# EAGLE design open-usb-can-rev2 (EAGLE 6.2)
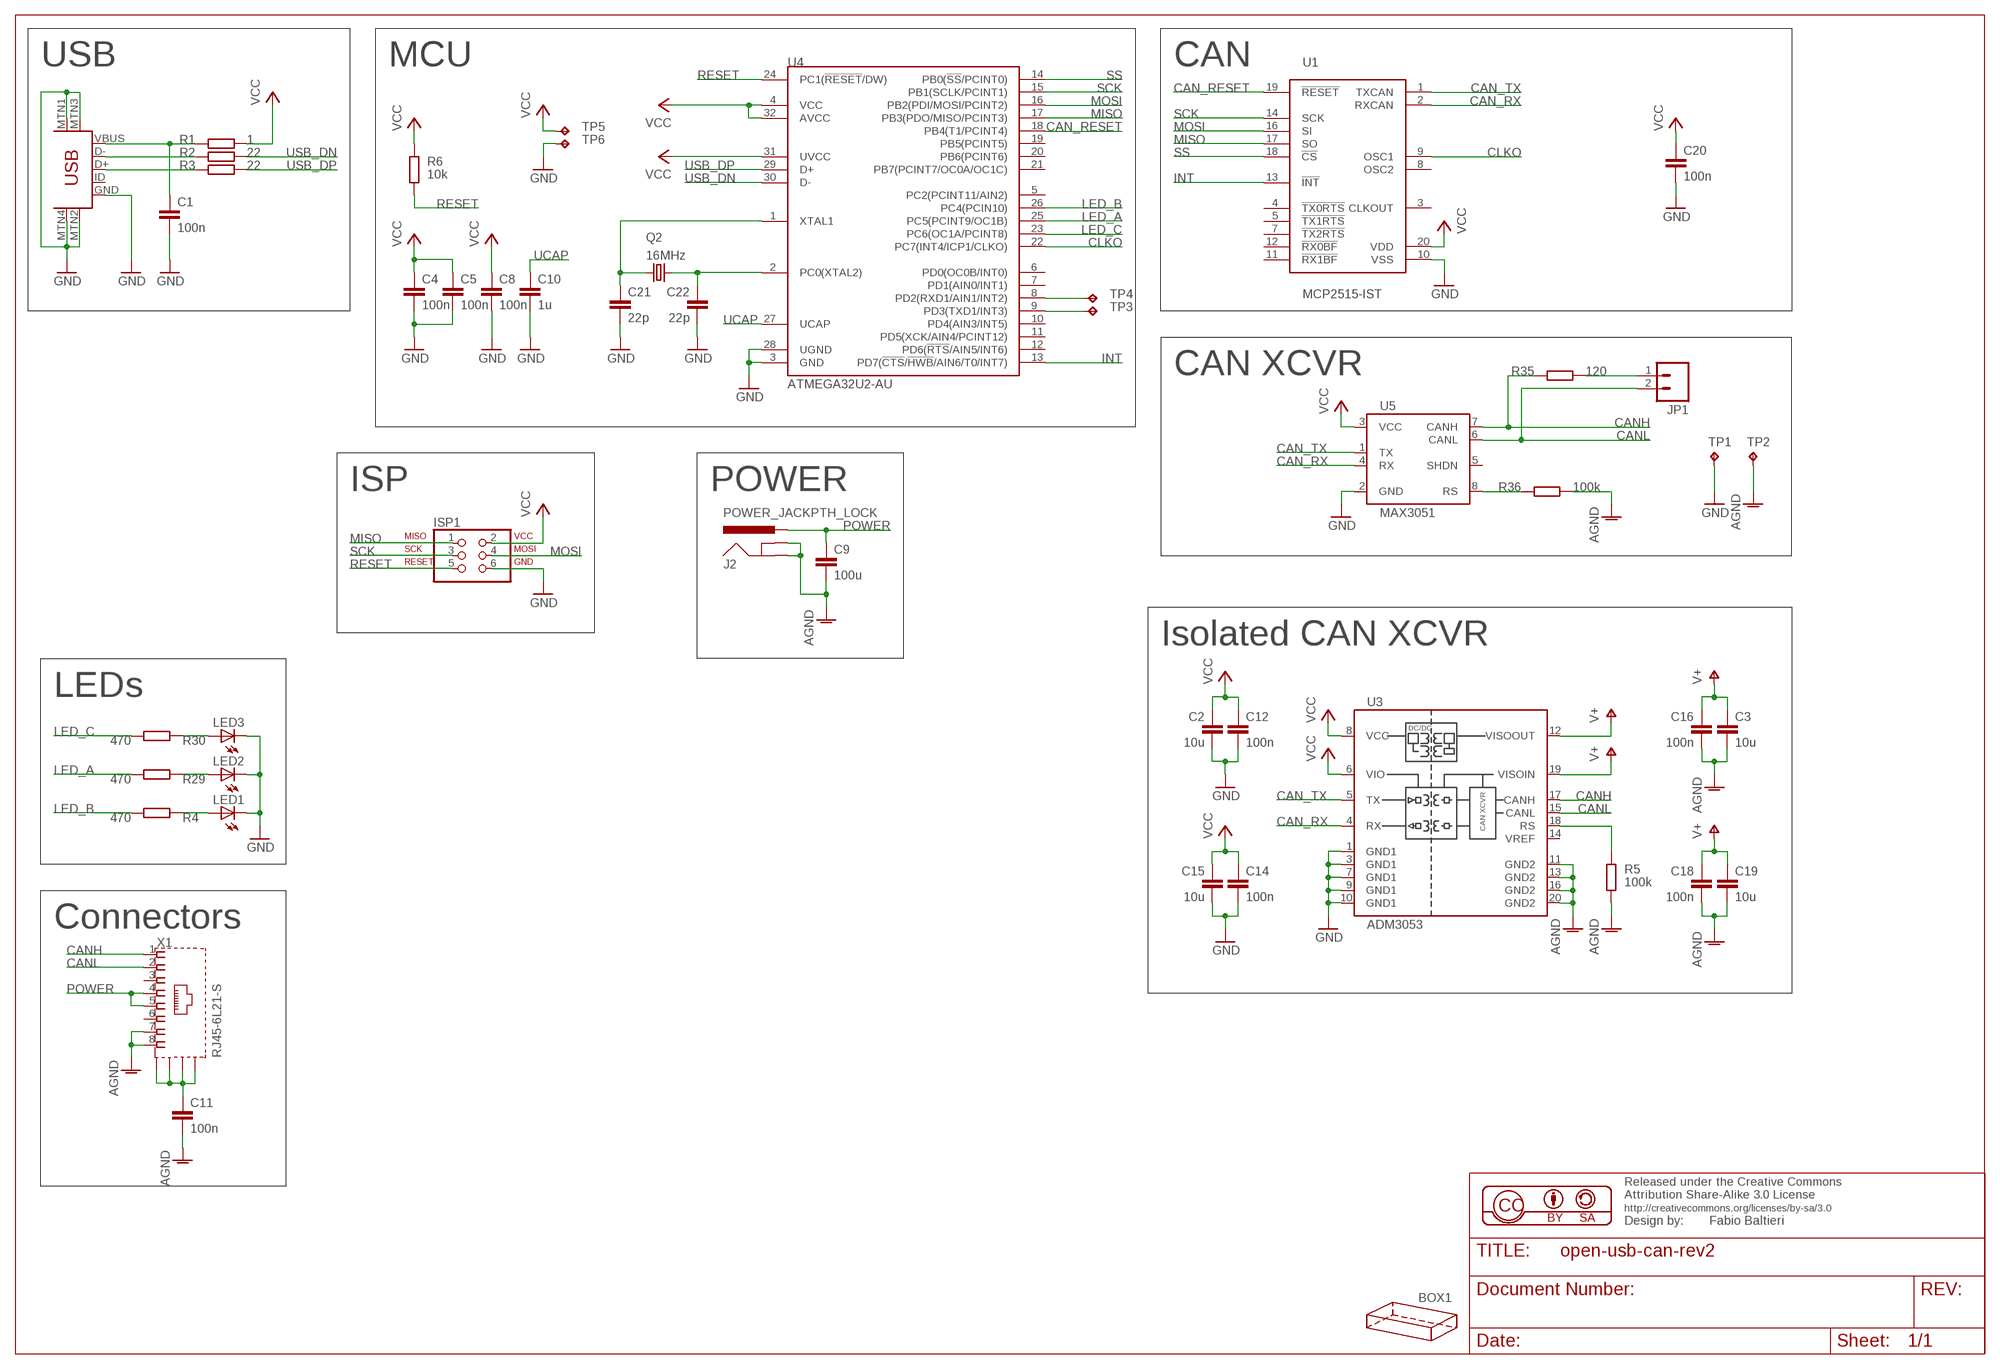
[diagram p0: schematic, sheet 1]

## Parts
BOX1  HAMMOND-BOX-R  [1151R]
C1  100n  C-EUC0805  [C0805]
C2  10u  C-EUC0805  [C0805]
C3  10u  C-EUC0805  [C0805]
C4  100n  C-EUC0805  [C0805]
C5  100n  C-EUC0805  [C0805]
C8  100n  C-EUC0805  [C0805]
C9  100u  C-EUC0805  [C0805]
C10  1u  C-EUC0805  [C0805]
C11  100n  C-EUC0805  [C0805]
C12  100n  C-EUC0805  [C0805]
C14  100n  C-EUC0805  [C0805]
C15  10u  C-EUC0805  [C0805]
C16  100n  C-EUC0805  [C0805]
C18  100n  C-EUC0805  [C0805]
C19  10u  C-EUC0805  [C0805]
C20  100n  C-EUC0805  [C0805]
C21  22p  C-EUC0805  [C0805]
C22  22p  C-EUC0805  [C0805]
ISP1  ISP-AVR910PTH  [2X03]
J2  POWER_JACKPTH_LOCK  [POWER_JACK_PTH_LOCK]
JP1  M02PTH  [1X02]
LED1  LEDCHIPLED_0805  [CHIPLED_0805]
LED2  LEDCHIPLED_0805  [CHIPLED_0805]
LED3  LEDCHIPLED_0805  [CHIPLED_0805]
Q2  16MHz  CRYSTAL5X3  [CRYSTAL-SMD-5X3]
R1  1  R-EU_R0603  [R0603]
R2  22  R-EU_R0603  [R0603]
R3  22  R-EU_R0603  [R0603]
R4  470  R-EU_R0603  [R0603]
R5  100k  R-EU_R0603  [R0603]
R6  10k  R-EU_R0603  [R0603]
R29  470  R-EU_R0603  [R0603]
R30  470  R-EU_R0603  [R0603]
R35  120  R-EU_R0805  [R0805]
R36  100k  R-EU_R0603  [R0603]
TP1  TPTP16SQ  [TP16SQ]
TP2  TPTP16SQ  [TP16SQ]
TP3  TPTP11R  [TP11R]
TP4  TPTP11R  [TP11R]
TP5  TPTP11R  [TP11R]
TP6  TPTP11R  [TP11R]
U1  MCP2515-IST  [TSSOP20]
U3  ADM3053  [SO20W]
U4  ATMEGA32U2-AU  [TQFP32-08]
U5  MAX3051  [SO08]
U$2  USB-MINIB-5PIN  [USB-MINIB]
X1  RJ45-6L21-S  [RJ45-SHIELD1]

## Nets
AGND: C3.2 C9.2 C11.2 C16.2 C18.2 C19.2 J2.GND J2.GNDBREAK R5.2 R36.2 TP2.TP U3.11(GND2) U3.13(GND2) U3.16(GND2) U3.20(GND2) X1.7 X1.8
CAN_RESET: U1.19(!RESET) U4.18(PB4(T1/PCINT4))
CAN_RX: U1.2(RXCAN) U3.4(RX) U5.4(RX)
CAN_TX: U1.1(TXCAN) U3.5(TX) U5.1(TX)
CANH: R35.1 U3.17(CANH) U5.7(CANH) X1.1
CANL: JP1.2 U3.15(CANL) U5.6(CANL) X1.2
CLKO: U1.9(OSC1) U4.22(PC7(INT4/ICP1/CLKO))
GND: C1.2 C2.2 C4.2 C5.2 C8.2 C10.2 C12.2 C14.2 C15.2 C20.2 C21.2 C22.2 ISP1.6 LED1.C LED2.C LED3.C TP1.TP TP6.TP U1.10(VSS) U3.1(GND1) U3.3(GND1) U3.7(GND1) U3.9(GND1) U3.10(GND1) U4.3(GND) U4.28(UGND) U5.2(GND) U$2.GND U$2.MTN1(MTN2) U$2.MTN2(MTN3) U$2.MTN3(MTN1) U$2.MTN4
INT: U1.13(!INT) U4.13(PD7(!CTS!/!HWB!/AIN6/T0/INT7))
LED_A: R29.2 U4.25(PC5(PCINT9/OC1B))
LED_B: R4.2 U4.26(PC4(PCIN10))
LED_C: R30.2 U4.23(PC6(OC1A/PCINT8))
MISO: ISP1.1 U1.17(SO) U4.17(PB3(PDO/MISO/PCINT3))
MOSI: ISP1.4 U1.16(SI) U4.16(PB2(PDI/MOSI/PCINT2))
N$1 [power16]: C1.1 R1.1 U$2.VBUS
N$2: R2.1 U$2.D-
N$3: R3.1 U$2.D+
N$6: C21.1 Q2.1 U4.1(XTAL1)
N$7: C22.1 Q2.3 U4.2(PC0(XTAL2))
N$8: LED1.A R4.1
N$9: C11.1 X1.S1(S) X1.S2(S) X1.S3(S) X1.S4(S)
N$11: R5.1 U3.18(RS)
N$23: LED2.A R29.1
N$24: LED3.A R30.1
N$25: R36.1 U5.8(RS)
N$27: JP1.1 R35.2
POWER: C9.1 J2.PWR X1.4 X1.5
RESET: ISP1.5 R6.2 U4.24(PC1(!RESET!/DW))
RX: TP4.TP U4.8(PD2(RXD1/AIN1/INT2))
SCK: ISP1.3 U1.14(SCK) U4.15(PB1(SCLK/PCINT1))
SS: U1.18(!CS) U4.14(PB0(!SS!/PCINT0))
TX: TP3.TP U4.9(PD3(TXD1/INT3))
UCAP [power12]: C10.1 U4.27(UCAP)
USB_DN: R2.2 U4.30(D-)
USB_DP: R3.2 U4.29(D+)
V+: C3.1 C16.1 C18.1 C19.1 U3.12(VISOOUT) U3.19(VISOIN)
VCC [power16]: C2.1 C4.1 C5.1 C8.1 C12.1 C14.1 C15.1 C20.1 ISP1.2 R1.2 R6.1 TP5.TP U1.20(VDD) U3.6(VIO) U3.8(VCC) U4.4(VCC) U4.31(UVCC) U4.32(AVCC) U5.3(VCC)
Unconnected: U1.3(CLKOUT) U1.4(!TX0RTS) U1.5(!TX1RTS) U1.7(!TX2RTS) U1.8(OSC2) U1.11(!RX1BF) U1.12(!RX0BF) U3.2(NC) U3.14(VREF) U4.5(PC2(PCINT11/AIN2)) U4.6(PD0(OC0B/INT0)) U4.7(PD1(AIN0/INT1)) U4.10(PD4(AIN3/INT5)) U4.11(PD5(XCK/AIN4/PCINT12)) U4.12(PD6(!RTS!/AIN5/INT6)) U4.19(PB5(PCINT5)) U4.20(PB6(PCINT6)) U4.21(PB7(PCINT7/OC0A/OC1C)) U5.5(SHDN) U$2.ID X1.3 X1.6

## Notes on the sheet
- USB | MCU | CAN
- CAN XCVR
- ISP | POWER
- Isolated CAN XCVR
- LEDs
- Connectors

## Library data of the parts
BOX1 = hammond:HAMMOND-BOX: Hammond Project boxes Hammond 1551 Transluscent Blue 50x35x20mm 1551GTBU http://www.hammondmfg.com/pdf/1551G.pdf Hammond 1551 Transluscent Blue 50x50x20mm 1551RTBU http://www.hammondmfg.com/pdf/1551R.pdf Hammond 1551 Transluscent Blue 60x35x20mm 1551HTBU http://www.hammondmfg.com/pdf/1551H.pdf Hammond 1551 Transluscent Blue 80x40x20mm 1551KTBU http://www.hammondmfg.com/pdf/1551K.pdf Hammond 1591 Transluscent Blue 100x51x22m m 1591XXATBU http://www.hammondmfg.com/pdf/1591XXA.pdf
C1-C5 C8-C12 C14-C16 C18-C22 = rcl:C-EU: CAPACITOR, European symbol
ISP1 = balto:ISP-AVR910: PIN HEADER
J2 = sparkfun:POWER_JACK: Power Jack This is the standard 5.5mm barrel jack for power. The PTH is the most common, proven, reliable, footprint. All others are experimental. The Slot footprint only works if the mill layer is transmitted to the PCB fab house so be warned. Spark Fun Electronics SKU : PRT-00119. Mating wall wart : TOL-00298 (and others)
JP1 = SparkFun-Connectors:M02: Header 2 Standard 2-pin 0.1" header. Use with straight break away headers (SKU : PRT-00116), right angle break away headers (PRT-00553), swiss pins (PRT-00743), machine pins (PRT-00117), and female headers (PRT-00115). Molex polarized connector foot print use with SKU : PRT-08233 with associated crimp pins and housings.
LED1-LED3 = led:LED: LED OSRAM: - CHIPLED LG R971, LG N971, LY N971, LG Q971, LY Q971, LO R971, LY R971 LH N974, LH R974 LS Q976, LO Q976, LY Q976 LO Q996 - Hyper CHIPLED LW Q18S LB Q993, LB Q99A, LB R99A - SideLED LS A670, LO A670, LY A670, LG A670, LP A670 LB A673, LV A673, LT A673, LW A673 LH A674 LY A675 LS A676, LA A676, LO A676, LY A676, LW A676 LS A679, LY A679, LG A679 - Hyper Micro SIDELED® LS Y876, LA Y876, LO Y876, LY Y876 LT Y87S - SmartLED LW L88C, LW L88S LB L89C, LB L89S, LG L890 LS L89K, LO L89K, LY L89K LS L896, LA L896, LO L896, LY L896 - TOPLED LS T670, LO T670, LY T670, LG T670, LP T670 LSG T670, LSP T670, LSY T670, LOP T670, LYG T670 LG T671, LOG T671, LSG T671 LB T673, LV T673, LT T673, LW T673 LH T674 LS T676, LA T676, LO T676, LY T676, LB T676, LH T676, LSB T676, LW T676 LB T67C, LV T67C, LT T67C, LS T67K, LO T67K, LY T67K, LW E67C LS E67B, LA E67B, LO E67B, LY E67B, LB E67C, LV E67C, LT E67C LW T67C LS T679, LY T679, LG T679 LS T770, LO T770, LY T770, LG T770, LP T770 LB T773, LV T773, LT T773, LW T773 LH T774 LS E675, LA E675, LY E675, LS T675 LS T776, LA T776, LO T776, LY T776, LB T776 LHGB T686 LT T68C, LB T68C - Hyper Mini TOPLED® LB M676 - Mini TOPLED Santana® LG M470 LS M47K, LO M47K, LY M47K Source: http://www.osram.convergy.de LUXEON: - LUMILED® LXK2-PW12-R00, LXK2-PW12-S00, LXK2-PW14-U00, LXK2-PW14-V00 LXK2-PM12-R00, LXK2-PM12-S00, LXK2-PM14-U00 LXK2-PE12-Q00, LXK2-PE12-R00, LXK2-PE12-S00, LXK2-PE14-T00, LXK2-PE14-U00 LXK2-PB12-K00, LXK2-PB12-L00, LXK2-PB12-M00, LXK2-PB14-N00, LXK2-PB14-P00, LXK2-PB14-Q00 LXK2-PR12-L00, LXK2-PR12-M00, LXK2-PR14-Q00, LXK2-PR14-R00 LXK2-PD12-Q00, LXK2-PD12-R00, LXK2-PD12-S00 LXK2-PH12-R00, LXK2-PH12-S00 LXK2-PL12-P00, LXK2-PL12-Q00, LXK2-PL12-R00 Source: www.luxeon.com KINGBRIGHT: KA-3528ASYC Source: www.kingbright.com
Q2 = sparkfun:CRYSTAL: Crystals Various standard crystals. Proven footprints. Spark Fun Electronics SKU : COM-00534
R1-R6 R29 R30 R35 R36 = rcl:R-EU_: RESISTOR, European symbol
TP1-TP6 = testpad:TP: Test pad
U1 = balto:MCP2515: MCP2515 Stand-Alone CAN Controller With SPI Interface
U3 = balto:ADM3053
U4 = balto:ATMEGA32U2: Atmel 8-bit Microcontroller with 8/16/32K Bystes of ISP Flash and USB Controller. ATmega8U2, ATmega16U2, and ATmega32U2
U5 = balto:MAX3051
U$2 = sparkfun:USB-MINIB: Mini-USB "B" connector with 5th pin broken out. Created new symbol breaking out 5th "ID" pin in mini/micro USB connector spec. See: http://en.wikipedia.org/wiki/Mini_usb#Cables. Uses same footprint as 4-pin symbol. Also added pins to connect to mounting / shield pads if required (probably not generally needed as signals aren't shielded once they leave the connector).
X1 = con-tycoelectronics:RJ45*2: RJ45 Low Profile Shield Type 2 For all RJ45 L, LC, LCT and X Series Models Source: www.tycoelectronics.com .. ENG_DS_1654001_1099_RJ_L_0507.pdf; OC_FARNELL: unknown; OC_NEWARK: unknown

## Net classes
1 power12: width 0.305 mm
2 power16: width 0.406 mm

## Board
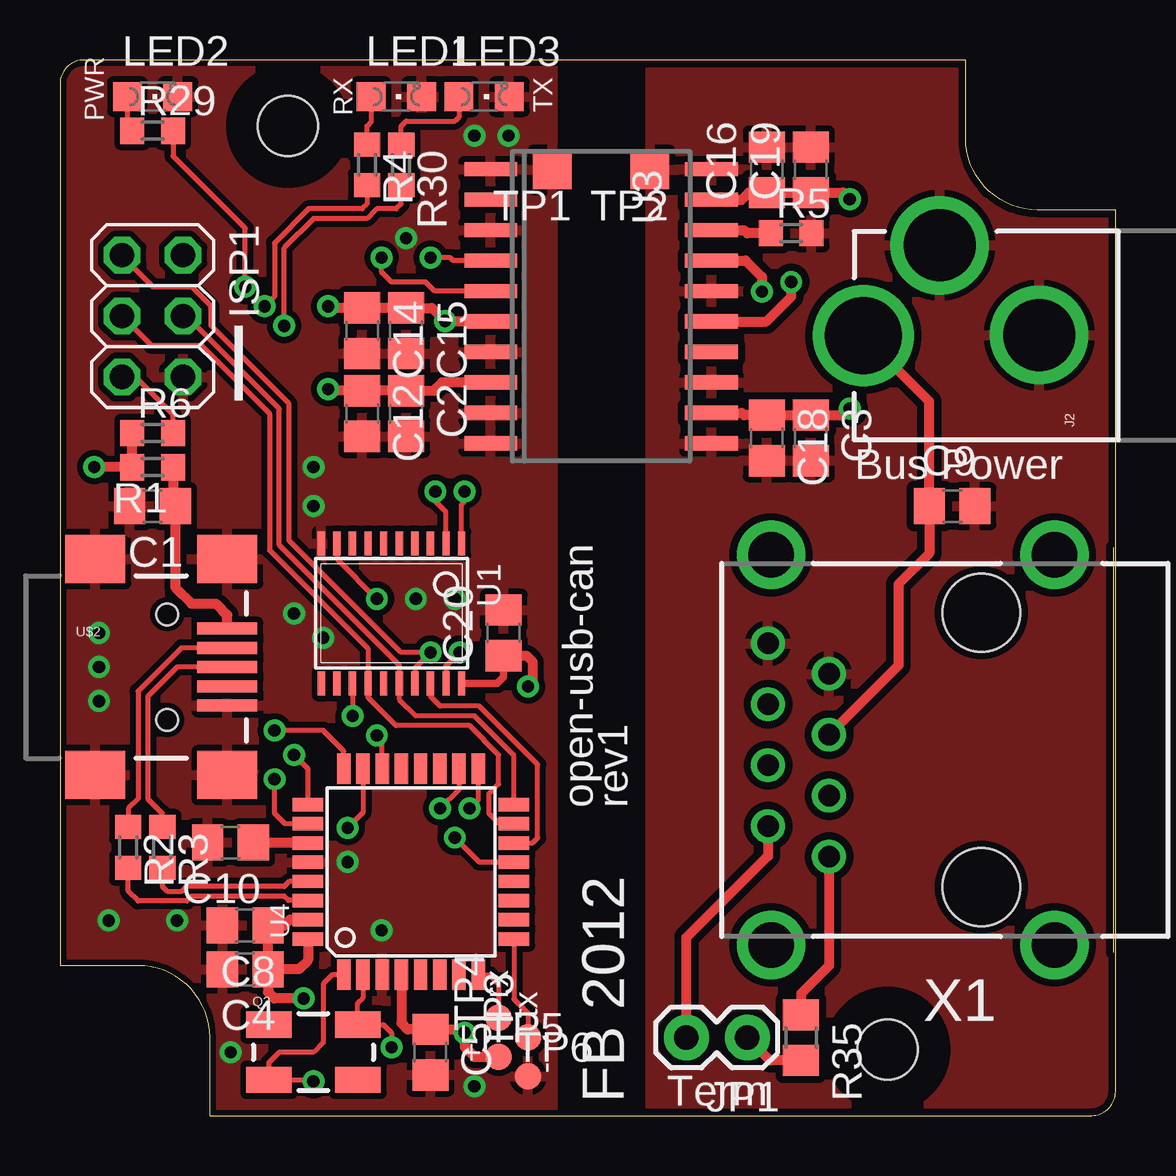
[diagram p1: board, top side]
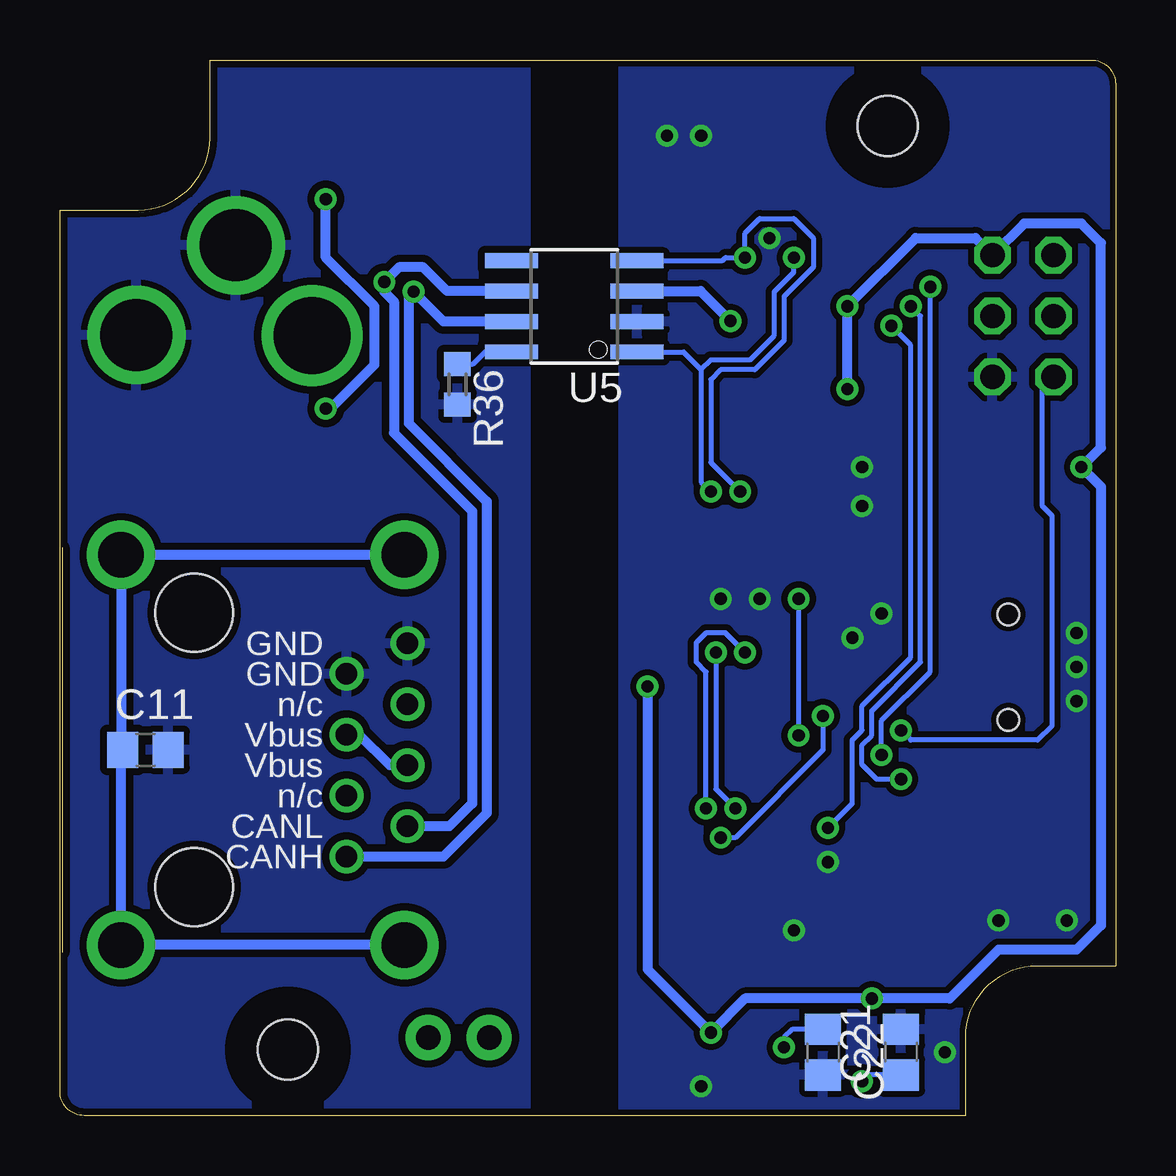
[diagram p2: board, bottom side, seen from below]

Size 44 x 44 mm. Coordinates in mm from the lower left corner, seen from the top.
Copper layers (1*16): Top 0.035mm / dielectric 1.5mm / Bottom 0.035mm
Design rules: minimum track width 8mil, minimum drill 20mil, track to track 8mil, track to pad 8mil, pad to pad 8mil, via to via 8mil, smd to smd 8mil, copper to edge 8mil, drill to drill 8mil, minimum pad ring 10mil, minimum via ring 8mil, stop-mask expansion 4mil, vias tented up to drill 20mil, thermal gap 10mil

### Footprints (pad centres in the part's own frame; a part is rotated, then mirrored left to right if it is on the bottom)
1151R = hole 2.5: 34.5,2.75; 9.5,41.25
C0805 = smd 1.3 x 1.5: 1 -0.95,0; 2 0.95,0
2X03 = drill 1.016 octagon: 1 -2.54,-1.27; 2 -2.54,1.27; 3 0,-1.27; 4 0,1.27; 5 2.54,-1.27; 6 2.54,1.27
POWER_JACK_PTH_LOCK = drill 2.997 pad 4.115: GND 0.025,6.557; GNDBREAK 3.762,10.7 | drill 3.2 pad 4.115: PWR 0,13.878
1X02 = drill 1.016 pad 1.88: 1 0,0; 2 2.54,0
CHIPLED_0805 = smd 1.2 x 1.2: A 0,-1.05; C 0,1.05
CRYSTAL-SMD-5X3 = smd 1.9 x 1.1: 1 -1.85,-1.15; 2 1.85,-1.15; 3 1.85,1.15; 4 -1.85,1.15
R0603 = smd 1 x 1.1: 1 -0.85,0; 2 0.85,0
R0805 = smd 1.3 x 1.5: 1 -0.95,0; 2 0.95,0
TP16SQ = smd 1.6 x 1.6: TP 0,0
TP11R = smd 1.1 x 1.1: TP 0,0
TSSOP20 = smd 0.305 x 0.991: 1 -2.925,-2.918; 2 -2.275,-2.918; 3 -1.625,-2.918; 4 -0.975,-2.918; 5 -0.325,-2.918; 6 0.325,-2.918; 7 0.975,-2.918; 8 1.625,-2.918; 9 2.275,-2.918; 10 2.925,-2.918; 11 2.925,2.918; 12 2.275,2.918; 13 1.625,2.918; 14 0.975,2.918; 15 0.325,2.918; 16 -0.325,2.918; 17 -0.975,2.918; 18 -1.625,2.918; 19 -2.275,2.918; 20 -2.925,2.918
SO20W = smd 0.6 x 2.2: 1 -5.715,-4.6; 2 -4.445,-4.6; 3 -3.175,-4.6; 4 -1.905,-4.6; 5 -0.635,-4.6; 6 0.635,-4.6; 7 1.905,-4.6; 8 3.175,-4.6; 9 4.445,-4.6; 10 5.715,-4.6; 11 5.715,4.6; 12 4.445,4.6; 13 3.175,4.6; 14 1.905,4.6; 15 0.635,4.6; 16 -0.635,4.6; 17 -1.905,4.6; 18 -3.175,4.6; 19 -4.445,4.6; 20 -5.715,4.6
TQFP32-08 = smd 1.27 x 0.559: 1 -4.293,2.8; 2 -4.293,2; 3 -4.293,1.2; 4 -4.293,0.4; 5 -4.293,-0.4; 6 -4.293,-1.2; 7 -4.293,-2; 8 -4.293,-2.8; 17 4.293,-2.8; 18 4.293,-2; 19 4.293,-1.2; 20 4.293,-0.4; 21 4.293,0.4; 22 4.293,1.2; 23 4.293,2; 24 4.293,2.8 | smd 0.559 x 1.27: 9 -2.8,-4.293; 10 -2,-4.293; 11 -1.2,-4.293; 12 -0.4,-4.293; 13 0.4,-4.293; 14 1.2,-4.293; 15 2,-4.293; 16 2.8,-4.293; 25 2.8,4.293; 26 2,4.293; 27 1.2,4.293; 28 0.4,4.293; 29 -0.4,4.293; 30 -1.2,4.293; 31 -2,4.293; 32 -2.8,4.293
SO08 = smd 0.61 x 2.21: 1 -1.905,-2.616; 2 -0.635,-2.616; 3 0.635,-2.616; 4 1.905,-2.616; 5 1.905,2.616; 6 0.635,2.616; 7 -0.635,2.616; 8 -1.905,2.616
USB-MINIB = smd 2.5 x 0.5: D+ 2.5,0; D- 2.5,0.8; GND 2.5,-1.6; ID 2.5,-0.8; VBUS 2.5,1.6 | smd 2.5 x 2: MTN1 -3,4.5; MTN2 2.5,4.5; MTN3 -3,-4.5; MTN4 2.5,-4.5 | hole 0.9: 0,2.2; 0,-2.2
RJ45-SHIELD1 = drill 0.9 pad 1.4: 1 -4.445,6.35; 2 -3.175,8.89; 3 -1.905,6.35; 4 -0.635,8.89; 5 0.635,6.35; 6 1.905,8.89; 7 3.175,6.35; 8 4.445,8.89 | drill 1.9 pad 2.5: S1 -8.128,-3.048; S2 8.128,-3.048; S3 -8.128,8.76; S4 8.128,8.76 | hole 3.251: -5.715,0; 5.715,0

### Placement (x,y rotation side)
BOX1  0,0 0 top
C1  3.86,25.4 180 top
C2  14.43,29.26 270 top
C3  31.29,28.24 270 top
C4  7.72,6.1 180 top
C5  15.44,2.64 270 top
C8  7.72,7.92 180 top
C9  37.19,25.4 0 top
C10  7.11,11.38 180 top
C11  40.44,15.24 0 bottom
C12  12.6,29.26 270 top
C14  12.6,32.72 270 top
C15  14.43,32.72 270 top
C16  29.46,39.42 90 top
C18  29.46,28.24 270 top
C19  31.29,39.42 90 top
C20  18.49,20.12 90 top
C21  8.94,2.64 90 bottom
C22  12.19,2.64 270 bottom
ISP1  3.86,33.32 270 top
J2  47.37,32.51 90 top
JP1  28.65,3.25 180 top
LED1  14.02,42.47 270 top
LED2  3.86,42.47 270 top
LED3  17.68,42.47 270 top
Q2  10.57,2.64 0 top
R1  3.86,27.03 180 top
R2  2.84,11.18 270 top
R3  4.27,11.18 270 top
R4  12.8,39.62 270 top
R5  30.48,36.78 0 top
R6  3.86,28.45 0 top
R29  3.86,41.05 0 top
R30  14.22,39.62 270 top
R35  30.89,3.25 270 top
R36  27.43,30.48 270 bottom
TP1  20.52,39.42 180 top
TP2  24.59,39.42 180 top
TP3  19.51,3.25 90 top
TP4  18.29,4.06 90 top
TP5  18.29,2.44 0 top
TP6  19.51,1.63 0 top
U1  13.82,20.93 180 top
U3  22.56,33.73 270 top
U4  14.63,10.16 90 top
U5  22.56,33.73 90 bottom
U$2  4.47,18.69 0 top
X1  38.4,15.24 90 top

### Tracks (layer width: path | path; a pad name or v marks a point on that pad's centre or on a via)
AGND
  pour Top (isolate 0.305): 44.09,43.89 24.59,43.89 24.59,0 44.2,0
  pour Bottom (isolate 0.305): 44.09,43.89 24.59,43.89 24.59,0 44.2,0
CAN_RESET  (via drill 0.51)
  Top 0.203: v16.66,19.3 16.09,18.73 U1.19 | U4.18 16.63,13.58 v15.85,12.8
  Bottom 0.203: v16.66,19.3 16.66,13.61 v15.85,12.8
CAN_RX  (via drill 0.51)
  Top 0.203: U3.4 16.38,35.64 16.26,35.76 v15.44,35.76 | U1.2 16.09,25.16 15.65,25.6 v15.65,26.01
  Bottom 0.203: U5.4 16.38,35.64 16.26,35.76 v15.44,35.76 15.44,36.78 14.83,37.39 13.41,37.39 12.6,36.58 12.6,35.36 13.82,34.14 13.82,32.31 15.04,31.09 16.46,31.09 16.87,30.68 16.87,27.23 v15.65,26.01
CAN_TX  (via drill 0.51)
  Top 0.203: U3.5 15.62,34.37 15.24,34.75 13.82,34.75 13.41,35.15 v13.41,35.76 | U1.1 16.74,25.48 16.87,25.6 v16.87,26.01
  Bottom 0.203: U5.1 18.01,31.83 17.27,31.09 | v13.41,35.76 13.41,35.15 14.22,34.34 14.22,32.51 15.24,31.5 16.87,31.5 17.27,31.09 | 17.27,31.09 17.27,26.42 v16.87,26.01
CANH  (via drill 0.51)
  Top 0.406: U3.17 28.57,35.64 29.26,34.95 v29.26,34.34 | X1.1 32.05,6.25 30.89,5.08 R35.1
  Bottom 0.406: U5.7 28.02,33.1 v29.26,34.34 29.46,34.14 29.46,28.85 26.21,25.6 26.21,12.6 28.02,10.79 X1.1
CANL  (via drill 0.51)
  Top 0.406: U3.15 29.44,33.1 30.48,34.14 v30.48,34.75 | X1.2 29.52,10.82 26.11,7.42 JP1.2
  Bottom 0.406: U5.6 27.86,34.37 28.85,35.36 29.87,35.36 v30.48,34.75 30.48,34.34 30.07,33.93 30.07,28.45 26.82,25.2 26.82,13.01 27.76,12.06 X1.2
CLKO  (via drill 0.51)
  Top 0.203: v13.21,21.54 11.54,23.2 U1.9 | U4.22 13.43,15.63 v13.21,15.85
  Bottom 0.203: v13.21,15.85 v13.21,21.54
GND  (via drill 0.51)
  other vias: 1.63,20.12 1.63,18.69 1.63,17.27 14.43,36.58 13.41,7.72 11.99,10.57 2.03,8.13 7.11,2.64 17.27,1.22 4.88,8.13 9.75,20.93 17.27,40.84 18.69,40.84 16.46,21.54 14.83,21.54 10.97,19.91 10.57,25.4 10.57,27.03
  pour Bottom (isolate 0.254): 20.52,0 0,0 0,43.89 20.52,43.89
  pour Top (isolate 0.254): 20.52,0 0,0 0,43.89 20.52,43.89
INT  (via drill 0.51)
  Top 0.203: U1.13 v12.19,16.66 | U4.13 17.48,10.56 v16.46,11.58
  Bottom 0.203: v12.19,16.66 12.19,15.24 15.85,11.58 v16.46,11.58
LED_A  (via drill 0.51)
  Top 0.203: U4.25 10.34,14.45 v9.75,15.04 | v7.72,34.54 7.72,36.98 4.71,39.99 R29.2
  Bottom 0.203: v9.75,15.04 9.75,16.46 7.72,18.49 v7.72,34.54
LED_B  (via drill 0.51)
  Top 0.203: U4.26 9.38,12.16 8.94,12.6 v8.94,14.02 | v8.53,33.73 8.94,34.14 8.94,36.37 10.36,37.8 12.6,37.8 12.8,38 R4.2
  Bottom 0.203: v8.94,14.02 9.96,14.02 10.57,14.63 10.57,15.44 10.16,15.85 10.16,16.87 8.13,18.9 8.13,33.33 v8.53,33.73
LED_C  (via drill 0.51)
  Top 0.203: U4.23 12.63,12.63 v11.99,11.99 | v9.35,32.92 9.35,36.17 10.57,37.39 12.8,37.39 13.21,37.8 14.02,37.8 14.22,38 R30.2
  Bottom 0.203: v11.99,11.99 10.97,13.01 10.97,15.65 10.57,16.05 10.57,17.07 8.53,19.1 8.53,32.11 v9.35,32.92
MISO  (via drill 0.51)
  Top 0.203: U4.17 17.43,13.16 v17.07,12.8 | U1.17 14.79,18.65 v15.44,19.3 14.22,19.3 9.55,23.98 9.55,29.67 6.3,32.92 6.3,33.73 5.49,34.54 3.86,34.54 2.59,35.81 ISP1.1
  Bottom 0.203: v15.44,19.3 16.26,20.12 17.07,20.12 17.48,19.71 17.48,18.9 17.07,18.49 v17.07,12.8
MOSI
  Top 0.203: U4.16 18.92,15.01 17.27,16.66 14.83,16.66 14.14,17.35 U1.16 14.14,18.78 9.14,23.77 9.14,29.46 5.28,33.33 ISP1.4
N$1
  Top 0.406: R1.1 4.71,25.5 C1.1 4.81,22.01 5.49,21.34 6.5,21.34 6.97,20.87 U$2.VBUS
N$2
  Top 0.203: U$2.D- 5.07,19.49 3.25,17.68 3.25,13.21 2.85,12.8 R2.1
N$3
  Top 0.203: U$2.D+ 4.88,18.69 3.66,17.48 3.66,13.21 4.27,12.6 R3.1
N$6  (via drill 0.51)
  Top 0.203: U4.1 11.35,5.87 10.97,5.49 10.97,3.05 10.57,2.64 9.14,2.64 8.72,2.21 Q2.1 10.5,1.49 v10.57,1.42
  Bottom 0.203: C21.1 10.3,1.69 v10.57,1.42
N$7  (via drill 0.51)
  Top 0.203: v13.82,2.85 13.82,3.45 13.48,3.79 Q2.3 12.42,4.7 12.63,4.91 U4.2
  Bottom 0.203: C22.1 13.48,3.59 13.82,3.25 v13.82,2.85
N$8
  Top 0.203: R4.1 12.8,41.25 12.97,41.42 LED1.A
N$9
  Bottom 0.406: X1.S4 X1.S2 41.45,15.31 C11.1 41.45,15.17 X1.S1 X1.S3
N$11
  Top 0.406: U3.18 28.52,36.91 28.65,36.78 R5.1
N$23
  Top 0.203: LED2.A 2.81,41.25 R29.1
N$24
  Top 0.203: R30.1 14.22,41.25 14.43,41.45 16.46,41.45 16.63,41.62 LED3.A
N$25
  Bottom 0.203: U5.8 26.29,31.83 26.79,31.33 R36.1
N$27
  Top 0.406: R35.2 29.6,2.3 JP1.1
POWER
  Top 0.406: J2.PWR 36.24,29.77 C9.1 36.24,23.43 34.95,22.15 34.95,18.77 X1.5
  Bottom 0.406: X1.4 30.25,14.61 31.52,15.88 X1.5
RESET  (via drill 0.51)
  Top 0.203: U4.24 11.83,15.2 10.97,16.05 v8.94,16.05 | ISP1.5 3.15,30.79 4.71,29.22 R6.2
  Bottom 0.203: v8.94,16.05 8.53,15.65 3.25,15.65 2.64,16.26 2.64,24.99 3.05,25.4 3.05,30.33 ISP1.5
RX
  Top 0.203: U4.8 17.91,5.87 18.29,5.49 TP4.TP
SCK
  Top 0.203: U4.15 18.32,12.16 17.88,12.6 17.88,13.41 18.29,13.82 18.29,15.04 17.07,16.26 14.02,16.26 12.84,17.43 U1.14 12.84,19.47 8.74,23.57 8.74,29.26 5.89,32.11 3.81,32.11 ISP1.3
SS
  Top 0.203: U4.14 19.69,11.36 19.91,11.58 19.91,14.63 17.48,17.07 15.85,17.07 15.44,17.48 U1.18
TX
  Top 0.203: U4.9 18.92,4.85 19.51,4.27 TP3.TP
UCAP
  Top 0.406: U4.27 8.08,11.36 C10.1
USB_DN
  Top 0.203: U4.30 9.53,8.96 9.35,9.14 5.49,9.14 5.28,8.94 3.25,8.94 2.85,9.35 R2.2
USB_DP
  Top 0.203: U4.29 9.56,9.76 9.35,9.55 5.28,9.55 5.08,9.35 4.47,9.35 4.27,9.55 R3.2
V+  (via drill 0.51)
  Top 0.406: U3.19 28.42,38.18 28.72,38.47 C16.1 C19.1 32.65,38.47 v32.92,38.2 | U3.12 28.42,29.29 28.51,29.2 C18.1 C3.1 32.65,29.2 v32.92,29.46
  Bottom 0.406: v32.92,29.46 32.72,29.46 30.89,31.29 30.89,33.73 32.92,35.76 v32.92,38.2
VCC  (via drill 0.51)
  Top 0.305: U1.20 18.21,18.01 18.49,18.29 C20.1
  Top 0.406: U4.31 9.58,8.16 9.35,7.92 C8.1 C4.1 | C4.1 9.96,6.1 10.34,6.48 U4.32 | v10.16,4.88 8.94,4.88 8.67,5.15 C4.1 | U3.8 15.93,30.56 15.58,30.21 C2.1 C12.1 11.24,30.21 v11.18,30.28 | v1.42,27.03 R1.2 R6.1 | v19.51,17.88 19.71,18.09 19.71,18.9 19.44,19.17 C20.1 | U3.6 16.08,33.1 v16.05,33.12 15.51,33.66 C15.1 C14.1 11.24,33.66 v11.18,33.73 | U4.4 14.23,3.85 14.49,3.59 C5.1 16.73,3.59 v16.87,3.45 16.87,2.85 17.27,2.44 TP5.TP
  Bottom 0.406: U5.3 17.3,34.37 v16.05,33.12 | v11.18,30.28 v11.18,33.73 8.33,36.58 5.84,36.58 ISP1.2 3.81,37.19 1.42,37.19 0.61,36.37 0.61,27.84 v1.42,27.03 0.61,26.21 0.61,7.92 1.63,6.91 4.88,6.91 6.91,4.88 v10.16,4.88 15.44,4.88 v16.87,3.45 19.51,6.1 v19.51,17.88

### Text on the board
_tsilk: RX | TX | PWR | _ | Bus Power | open-usb-can | rev1 | rx | tx | + | - | FB 2012 | Term
_bsilk: GND | GND | n/c | Vbus | Vbus | n/c | CANL | CANH